# Altium schematic sheet fet_driver.SchDoc
size Tabloid
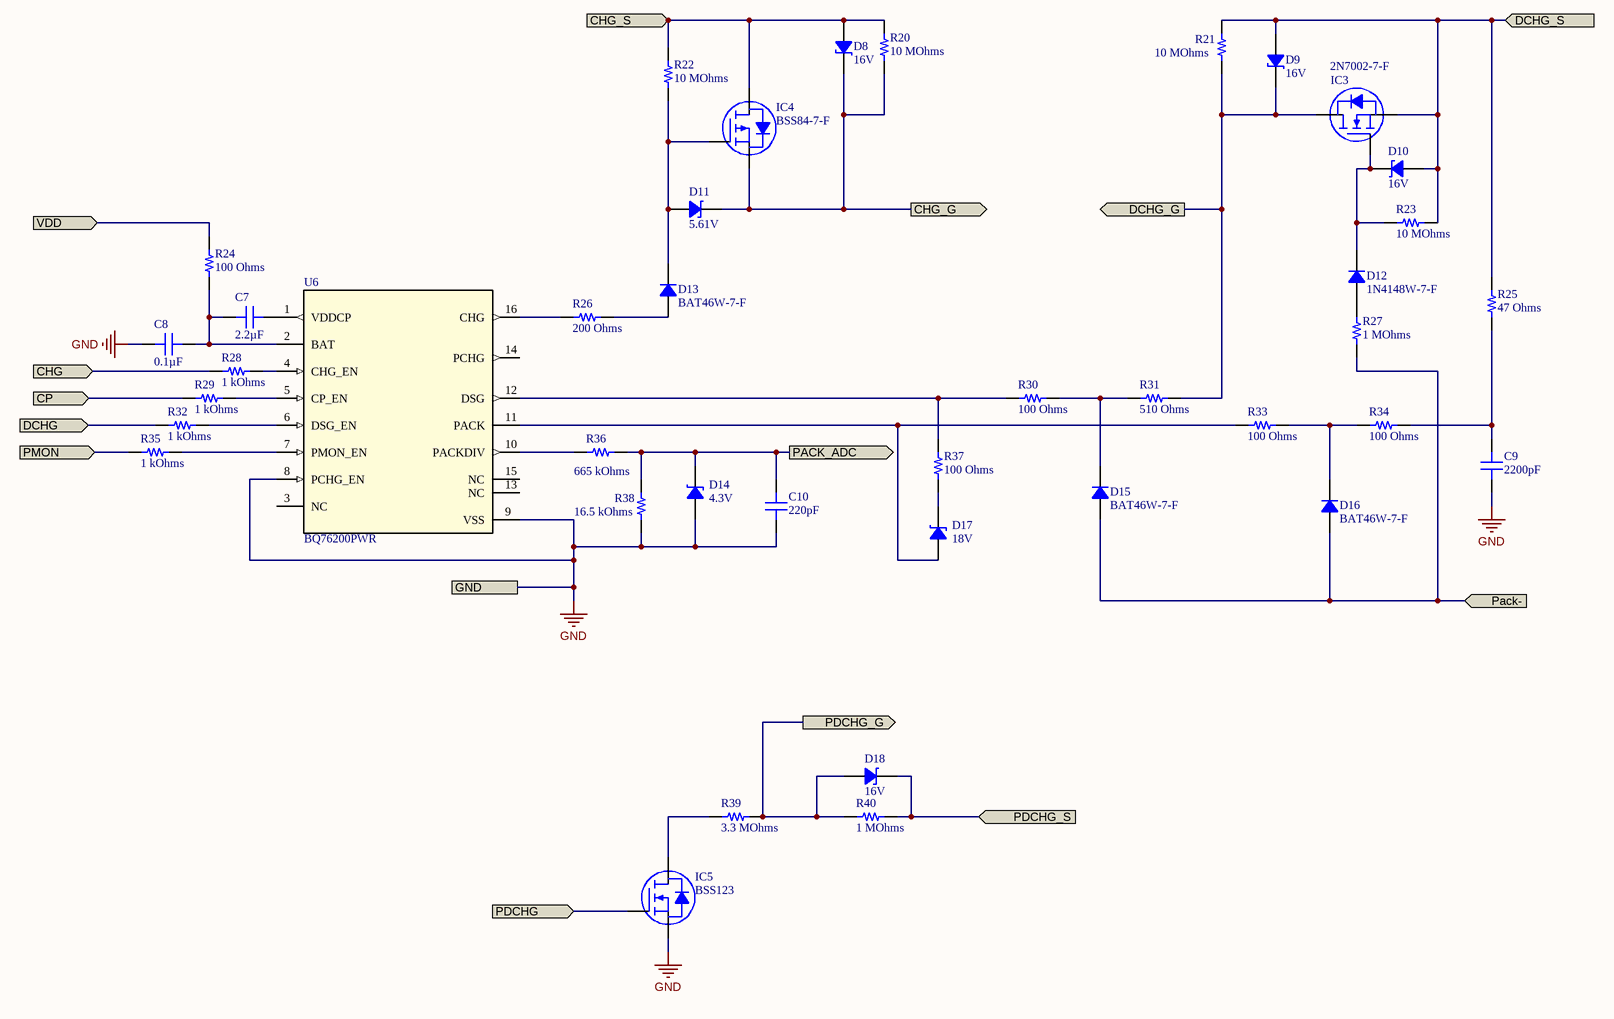
[diagram p0: fet_driver.SchDoc]

## Parts
C7  2.2µF  [CAP 1210_3225 - 2.5MM]
C8  0.1µF  [CAP 0603_1608]
C9  2200pF  [CAP 0603_1608]
C10  220pF  [CAP 0603_1608]
D8  Voltage - Zener (Nom) (Vz): 16V  [SOD-123]  (hidden comment: MMSZ5246B-7-F)
D9  Voltage - Zener (Nom) (Vz): 16V  [SOD-123]  (hidden comment: MMSZ5246B-7-F)
D10  Voltage - Zener (Nom) (Vz): 16V  [SOD-123]  (hidden comment: MMSZ5246B-7-F)
D11  Voltage - Zener (Nom) (Vz): 5.61V  [SOD523F]  (hidden comment: MM5Z5V6ST1G)
D12  1N4148W-7-F  [SOD-123]
D13  BAT46W-7-F  [SOD-123]
D14  Voltage - Zener (Nom) (Vz): 4.3V  [SOD-123]  (hidden comment: MMSZ5229BT1G)
D15  BAT46W-7-F  [SOD-123]
D16  BAT46W-7-F  [SOD-123]
D17  Voltage - Zener (Nom) (Vz): 18V  [DIODES SOT-523]  (hidden comment: MMBZ5248BT-7-F)
D18  Voltage - Zener (Nom) (Vz): 16V  [SOD-123]  (hidden comment: MMSZ5246B-7-F)
IC3  2N7002-7-F  [DIODES SOT-23-3]
IC4  BSS84-7-F  [DIODES SOT-23-3]
IC5  BSS123  [ON SEMI SOT-23-3]
R20  10 MOhms  [RES 0603_1608]
R21  10 MOhms  [RES 0603_1608]
R22  10 MOhms  [RES 0603_1608]
R23  10 MOhms  [RES 0603_1608]
R24  100 Ohms  [RES 0603_1608]
R25  47 Ohms  [RES 0603_1608]
R26  200 Ohms  [RES 0603_1608]
R27  1 MOhms  [RES 0603_1608]
R28  1 kOhms  [RES 0603_1608]
R29  1 kOhms  [RES 0603_1608]
R30  100 Ohms  [RES 0603_1608]
R31  510 Ohms  [RES 0603_1608]
R32  1 kOhms  [RES 0603_1608]
R33  100 Ohms  [RES 0603_1608]
R34  100 Ohms  [RES 0603_1608]
R35  1 kOhms  [RES 0603_1608]
R36  665 kOhms  [RES 0603_1608]
R37  100 Ohms  [RES 0603_1608]
R38  16.5 kOhms  [RES 0603_1608]
R39  3.3 MOhms  [RES 0603_1608]
R40  1 MOhms  [RES 0603_1608]
U6  BQ76200PWR  [TSSOP_16]

## Ports
CHG (in), CHG_G (out), CHG_S (in), CP (in), DCHG (in), DCHG_G (out), DCHG_S (in), GND, Pack- (in), PACK_ADC (out), PDCHG (in), PDCHG_G (out), PDCHG_S (in), PMON (in), VDD (in)

## Nets
GND: C8.1 C9.1 C10.1 D14.1 IC5.2(S) R38.1 U6.8(PCHG_EN) U6.9(VSS) ; port GND
CHG: R28.1 ; port CHG
CHG_G: D8.2 D11.2 IC4.2(S) R20.1 ; port CHG_G
CHG_S: D8.1 IC4.3(D) R20.2 R22.2 ; port CHG_S
CP: R29.1 ; port CP
DCHG: R32.1 ; port DCHG
DCHG_G: D9.2 IC3.3(D) R21.1 R31.2 ; port DCHG_G
DCHG_S: D9.1 D10.1 IC3.2(S) R21.2 R23.1 R25.2 ; port DCHG_S
Pack-: D15.1 D16.1 R27.1 ; port Pack-
PACK_ADC: C10.2 D14.2 R36.2 R38.2 ; port PACK_ADC
PDCHG: IC5.1(G) ; port PDCHG
PDCHG_G: D18.1 R39.2 R40.2 ; port PDCHG_G
PDCHG_S: D18.2 R40.1 ; port PDCHG_S
PMON: R35.1 ; port PMON
VDD: R24.2 ; port VDD
NetC7_1: C7.1 C8.2 R24.1 U6.2(BAT)
NetC7_2: C7.2 U6.1(VDDCP)
NetC9_2: C9.2 R25.1 R34.1
NetD10_2: D10.2 D12.2 IC3.1(G) R23.2
NetD11_1: D11.1 D13.2 IC4.1(G) R22.1
NetD12_1: D12.1 R27.2
NetD13_1: D13.1 R26.2
NetD15_2: D15.2 R30.1 R31.1
NetD16_2: D16.2 R33.1 R34.2
NetD17_1: D17.1 R33.2 U6.11(PACK)
NetD17_2: D17.2 R37.2
NetIC5_3: IC5.3(D) R39.1
NetR26_1: R26.1 U6.16(CHG)
NetR28_2: R28.2 U6.4(CHG_EN)
NetR29_2: R29.2 U6.5(CP_EN)
NetR30_2: R30.2 R37.1 U6.12(DSG)
NetR32_2: R32.2 U6.6(DSG_EN)
NetR35_2: R35.2 U6.7(PMON_EN)
NetR36_1: R36.1 U6.10(PACKDIV)

Not connected (* = marked no-connect by the designer): U6 3(NC) 13(NC) 14(PCHG) 15(NC)

## Library data of the parts
C7 = C3225X7R2A225K230AE: CAP CER 2.2UF 100V X7R 1210; Manufacturer: TDK Corporation; Tolerance: ±10%; Part Number: C3225X7R2A225K230AE; Value: 2.2µF; Applications: Boardflex Sensitive; Capacitance: 2.2µF; ComponentLink1Description: Datasheet; ComponentLink1URL: https://product.tdk.com/info/en/catalog/datasheets/mlcc_commercial_soft_en.pdf?ref_disty=digikey; ComponentLink2Description: DigiKey Link; ComponentLink2URL: http://digikey.com/product-detail/en/tdk-corporation/C3225X7R2A225K230AE/445-8913-1-ND/3283757; Device Package: 1210 (3225 Metric); Features: Soft Termination; LastUpdated: 9/2/2020 1:10:44 AM; Lifecycle Status: Active; Minimum Order: 1; Mounting Type: Surface Mount, MLCC; Operating Temperature: -55°C ~ 125°C; Package / Case: 1210 (3225 Metric); Packaging: TapeAndReel; PartId: 24320; Part Status: Active; Price: 0.39; Series: C; Size / Dimension: 0.126" L x 0.098" W (3.20mm x 2.50mm); Supplier 1: DigiKey; Supplier Part Number 1: 445-8913-1-ND; Temperature Coefficient: X7R; Thickness (Max): 0.098" (2.50mm); Voltage - Rated: 100V
C8 = GCJ188R72A104KA01D: CAP CER 0.1UF 100V X7R 0603; Manufacturer: Murata Electronics; Tolerance: ±10%; Part Number: GCJ188R72A104KA01D; Value: 0.1µF; Applications: Automotive, Boardflex Sensitive; Capacitance: 0.1µF; ComponentLink1Description: Datasheet; ComponentLink1URL: https://www.murata.com/~/media/webrenewal/support/library/catalog/products/capacitor/mlcc/c03e.ashx?la=en-us; ComponentLink2Description: DigiKey Link; ComponentLink2URL: http://digikey.com/product-detail/en/murata-electronics/GCJ188R72A104KA01D/490-13420-1-ND/6012292; Device Package: 0603 (1608 Metric); Features: Soft Termination; LastUpdated: 9/2/2020 1:03:01 AM; Lifecycle Status: Active; Minimum Order: 1; Mounting Type: Surface Mount, MLCC; Operating Temperature: -55°C ~ 125°C; Package / Case: 0603 (1608 Metric); Packaging: TapeAndReel; PartId: 17976; Part Status: Active; Price: 0.05; Ratings: AEC-Q200; Series: GCJ; Size / Dimension: 0.063" L x 0.031" W (1.60mm x 0.80mm); Supplier 1: DigiKey; Supplier Part Number 1: 490-13420-1-ND; Temperature Coefficient: X7R; Thickness (Max): 0.035" (0.90mm); Voltage - Rated: 100V
C9 = CGA3E2X7R2A222K080AE: CAP CER 2200PF 100V X7R 0603; Manufacturer: TDK Corporation; Tolerance: ±10%; Part Number: CGA3E2X7R2A222K080AE; Value: 2200pF; Applications: Automotive, Boardflex Sensitive; Capacitance: 2200pF; ComponentLink1Description: Datasheet; ComponentLink1URL: https://product.tdk.com/info/en/catalog/datasheets/mlcc_automotive_soft_en.pdf?ref_disty=digikey; ComponentLink2Description: DigiKey Link; ComponentLink2URL: http://digikey.com/product-detail/en/tdk-corporation/CGA3E2X7R2A222K080AE/445-173761-1-ND/5809832; Device Package: 0603 (1608 Metric); Features: Soft Termination; LastUpdated: 9/2/2020 1:03:11 AM; Lifecycle Status: Active; Minimum Order: 1; Mounting Type: Surface Mount, MLCC; Operating Temperature: -55°C ~ 125°C; Package / Case: 0603 (1608 Metric); Packaging: TapeAndReel; PartId: 14930; Part Status: Active; Price: 0.03; Ratings: AEC-Q200; Series: CGA; Size / Dimension: 0.063" L x 0.031" W (1.60mm x 0.80mm); Supplier 1: DigiKey; Supplier Part Number 1: 445-173761-1-ND; Temperature Coefficient: X7R; Thickness (Max): 0.037" (0.95mm); Voltage - Rated: 100V
C10 = CC0603KRX7R9BB221: CAP CER 220PF 50V X7R 0603; Manufacturer: Yageo; Tolerance: ±10%; Part Number: CC0603KRX7R9BB221; Value: 220pF; Applications: General Purpose; Capacitance: 220pF; ComponentLink1Description: Datasheet; ComponentLink1URL: https://www.yageo.com/upload/media/product/productsearch/datasheet/mlcc/UPY-GPHC_X7R_6.3V-to-50V_18.pdf; ComponentLink2Description: DigiKey Link; ComponentLink2URL: http://digikey.com/product-detail/en/yageo/CC0603KRX7R9BB221/311-1077-1-ND/302987; Device Package: 0603 (1608 Metric); LastUpdated: 9/2/2020 1:03:05 AM; Lifecycle Status: Active; Minimum Order: 1; Mounting Type: Surface Mount, MLCC; Operating Temperature: -55°C ~ 125°C; Package / Case: 0603 (1608 Metric); Packaging: TapeAndReel; PartId: 16734; Part Status: Active; Price: 0.01; Series: CC; Size / Dimension: 0.063" L x 0.031" W (1.60mm x 0.80mm); Supplier 1: DigiKey; Supplier Part Number 1: 311-1077-1-ND; Temperature Coefficient: X7R; Thickness (Max): 0.035" (0.90mm); Voltage - Rated: 50V
D8-D10 D18 = MMSZ5246B-7-F: DIODE ZENER 16V 500MW SOD123; Manufacturer: Diodes Incorporated; Current - Reverse Leakage @ Vr: 100nA @ 12V; Impedance (Max) (Zzt): 17 Ohms; Tolerance: ±5%; Voltage - Forward (Vf) (Max) @ If: 900mV @ 10mA; Part Number: MMSZ5246B-7-F; ComponentLink1Description: Datasheet; ComponentLink1URL: https://www.diodes.com/assets/Datasheets/ds18010.pdf; ComponentLink2Description: DigiKey Link; ComponentLink2URL: http://digikey.com/product-detail/en/diodes-incorporated/MMSZ5246B-7-F/MMSZ5246B-FDICT-ND/717912; LastUpdated: 9/2/2020 1:19:27 AM; Lifecycle Status: Active; Minimum Order: 1; Mounting Type: Surface Mount; Operating Temperature: -65°C ~ 150°C; Package / Case: SOD-123; Packaging: TapeAndReel; PartId: 1896; Part Status: Active; Power - Max: 500mW; Price: 0.04; Series: -; Supplier 1: DigiKey; Supplier Part Number 1: MMSZ5246B-FDICT-ND; Supplier Device Package: SOD-123
D11 = MM5Z5V6ST1G: DIODE ZENER 5.61V 500MW SOD523; Manufacturer: ON Semiconductor; Current - Reverse Leakage @ Vr: 1µA @ 2V; Impedance (Max) (Zzt): 40 Ohms; Tolerance: ±2%; Voltage - Forward (Vf) (Max) @ If: 900mV @ 10mA; Part Number: MM5Z5V6ST1G; ComponentLink1Description: Datasheet; ComponentLink1URL: https://www.onsemi.com/pub/Collateral/MM5Z2V4ST1-D.PDF; ComponentLink2Description: DigiKey Link; ComponentLink2URL: http://digikey.com/product-detail/en/on-semiconductor/MM5Z5V6ST1G/MM5Z5V6ST1GOSCT-ND/964551; LastUpdated: 9/2/2020 1:19:35 AM; Lifecycle Status: Active; Minimum Order: 1; Mounting Type: Surface Mount; Operating Temperature: -65°C ~ 150°C; Package / Case: SC-79, SOD-523; Packaging: TapeAndReel; PartId: 3287; Part Status: Active; Power - Max: 500mW; Price: 0.05; Series: Automotive, AEC-Q101; Supplier 1: DigiKey; Supplier Part Number 1: MM5Z5V6ST1GOSCT-ND; Supplier Device Package: SOD-523
D12 = 1N4148W-7-F: DIODE GEN PURP 100V 300MA SOD123; Manufacturer: Diodes Incorporated; Current - Average Rectified (Io): 300mA (DC); Current - Reverse Leakage @ Vr: 1µA @ 75V; Diode Type: Standard; Reverse Recovery Time (trr): 4ns; Speed: Small Signal =< 200mA (Io), Any Speed; Voltage - Forward (Vf) (Max) @ If: 1.25V @ 150mA; Part Number: 1N4148W-7-F; ComponentLink1Description: Datasheet; ComponentLink1URL: https://www.diodes.com/assets/Datasheets/ds30086.pdf; ComponentLink2Description: DigiKey Link; ComponentLink2URL: http://digikey.com/product-detail/en/diodes-incorporated/1N4148W-7-F/1N4148W-FDICT-ND/815280; LastUpdated: 9/2/2020 1:19:08 AM; Lifecycle Status: Active; Minimum Order: 1; Mounting Type: Surface Mount; Operating Temperature - Junction: -65°C ~ 150°C; Package / Case: SOD-123; Packaging: TapeAndReel; PartId: 1002; Part Status: Active; Price: 0.03; Series: -; Supplier 1: DigiKey; Supplier Part Number 1: 1N4148W-FDICT-ND; Supplier Device Package: SOD-123; Voltage - DC Reverse (Vr) (Max): 100V
D13 D15 D16 = BAT46W-7-F: DIODE SCHOTTKY 100V 150MA SOD123; Manufacturer: Diodes Incorporated; Current - Average Rectified (Io): 150mA (DC); Current - Reverse Leakage @ Vr: 2µA @ 75V; Speed: Small Signal =< 200mA (Io), Any Speed; Voltage - Forward (Vf) (Max) @ If: 450mV @ 10mA; Part Number: BAT46W-7-F; ComponentLink1Description: Datasheet; ComponentLink1URL: https://www.diodes.com/assets/Datasheets/ds30044.pdf; ComponentLink2Description: DigiKey Link; ComponentLink2URL: http://digikey.com/product-detail/en/diodes-incorporated/BAT46W-7-F/BAT46W-7FDICT-ND/2181054; Diode Type: Schottky; LastUpdated: 9/2/2020 1:19:08 AM; Lifecycle Status: Active; Minimum Order: 1; Mounting Type: Surface Mount; Operating Temperature - Junction: -55°C ~ 125°C; Package / Case: SOD-123; Packaging: TapeAndReel; PartId: 2210; Part Status: Active; Price: 0.07; Series: Automotive, AEC-Q101; Supplier 1: DigiKey; Supplier Part Number 1: BAT46W-7FDICT-ND; Supplier Device Package: SOD-123; Voltage - DC Reverse (Vr) (Max): 100V
D14 = MMSZ5229BT1G: DIODE ZENER 4.3V 500MW SOD123; Manufacturer: ON Semiconductor; Current - Reverse Leakage @ Vr: 5µA @ 1V; Impedance (Max) (Zzt): 22 Ohms; Tolerance: ±5%; Voltage - Forward (Vf) (Max) @ If: 900mV @ 10mA; Part Number: MMSZ5229BT1G; ComponentLink1Description: Datasheet; ComponentLink1URL: http://www.onsemi.com/pub/Collateral/MMSZ5221BT1-D.PDF; ComponentLink2Description: DigiKey Link; ComponentLink2URL: http://digikey.com/product-detail/en/on-semiconductor/MMSZ5229BT1G/MMSZ5229BT1GOSCT-ND/1139889; LastUpdated: 9/2/2020 1:19:25 AM; Lifecycle Status: Active; Minimum Order: 1; Mounting Type: Surface Mount; Operating Temperature: -55°C ~ 150°C; Package / Case: SOD-123; Packaging: TapeAndReel; PartId: 2271; Part Status: Active; Power - Max: 500mW; Price: 0.04; Series: -; Supplier 1: DigiKey; Supplier Part Number 1: MMSZ5229BT1GOSCT-ND; Supplier Device Package: SOD-123
D17 = MMBZ5248BT-7-F: DIODE ZENER 18V 150MW SOT523; Manufacturer: Diodes Incorporated; Current - Reverse Leakage @ Vr: 100nA @ 14V; Impedance (Max) (Zzt): 21 Ohms; Tolerance: ±5%; Voltage - Forward (Vf) (Max) @ If: 900mV @ 10mA; Part Number: MMBZ5248BT-7-F; ComponentLink1Description: Datasheet; ComponentLink1URL: https://www.diodes.com/assets/Datasheets/ds30267.pdf; ComponentLink2Description: DigiKey Link; ComponentLink2URL: http://digikey.com/product-detail/en/diodes-incorporated/MMBZ5248BT-7-F/MMBZ5248BT-7-FDICT-ND/5218419; LastUpdated: 9/2/2020 1:21:31 AM; Lifecycle Status: Active; Minimum Order: 1; Mounting Type: Surface Mount; Operating Temperature: -65°C ~ 150°C; Package / Case: SOT-523; Packaging: CutTape; PartId: 789; Part Status: Active; Power - Max: 150mW; Price: 0.39; Series: -; Supplier 1: DigiKey; Supplier Part Number 1: MMBZ5248BT-7-FDICT-ND; Supplier Device Package: SOT-523
IC3 = 2N7002-7-F: MOSFET N-CH 60V 115MA SOT23-3; Manufacturer: Diodes Incorporated; Current - Continuous Drain (Id) @ 25°C: 115mA (Ta); Drive Voltage (Max Rds On,  Min Rds On): 5V, 10V; FET Type: N-Channel; Input Capacitance (Ciss) (Max) @ Vds: 50pF @ 25V; Power Dissipation (Max): 370mW (Ta); Rds On (Max) @ Id, Vgs: 7.5Ohm @ 50mA, 5V; Vgs (Max): ±20V; Vgs(th) (Max) @ Id: 2.5V @ 250µA; Part Number: 2N7002-7-F; ComponentLink1Description: Datasheet; ComponentLink1URL: https://www.diodes.com/assets/Datasheets/ds11303.pdf; ComponentLink2Description: DigiKey Link; ComponentLink2URL: http://digikey.com/product-detail/en/diodes-incorporated/2N7002-7-F/2N7002-FDICT-ND/717800; Drain to Source Voltage (Vdss): 60V; LastUpdated: 9/2/2020 1:25:03 AM; Lifecycle Status: Active; Minimum Order: 1; Mounting Type: Surface Mount; Operating Temperature: -55°C ~ 150°C (TJ); Package / Case: TO-236-3, SC-59, SOT-23-3; Packaging: TapeAndReel; Part Status: Active; Price: 0.03; Series: -; Supplier 1: DigiKey; Supplier Part Number 1: 2N7002-FDICT-ND; Supplier Device Package: SOT-23-3; Technology: MOSFET (Metal Oxide)
IC4 = BSS84-7-F: MOSFET P-CH 50V 130MA SOT23-3; Manufacturer: Diodes Incorporated; Current - Continuous Drain (Id) @ 25°C: 130mA (Ta); Drive Voltage (Max Rds On,  Min Rds On): 5V; FET Type: P-Channel; Input Capacitance (Ciss) (Max) @ Vds: 45pF @ 25V; Power Dissipation (Max): 300mW (Ta); Rds On (Max) @ Id, Vgs: 10Ohm @ 100mA, 5V; Vgs (Max): ±20V; Vgs(th) (Max) @ Id: 2V @ 1mA; Part Number: BSS84-7-F; ComponentLink1Description: Datasheet; ComponentLink1URL: https://www.diodes.com/assets/Datasheets/ds30149.pdf; ComponentLink2Description: DigiKey Link; ComponentLink2URL: http://digikey.com/product-detail/en/diodes-incorporated/BSS84-7-F/BSS84-FDICT-ND/717844; Drain to Source Voltage (Vdss): 50V; LastUpdated: 9/2/2020 1:25:04 AM; Lifecycle Status: Active; Minimum Order: 1; Mounting Type: Surface Mount; Operating Temperature: -55°C ~ 150°C (TJ); Package / Case: TO-236-3, SC-59, SOT-23-3; Packaging: TapeAndReel; Part Status: Active; Price: 0.03; Series: -; Supplier 1: DigiKey; Supplier Part Number 1: BSS84-FDICT-ND; Supplier Device Package: SOT-23-3; Technology: MOSFET (Metal Oxide)
IC5 = BSS123: MOSFET N-CH 100V 170MA SOT-23; Manufacturer: ON Semiconductor; Current - Continuous Drain (Id) @ 25°C: 170mA (Ta); Drive Voltage (Max Rds On,  Min Rds On): 4.5V, 10V; FET Type: N-Channel; Gate Charge (Qg) (Max) @ Vgs: 2.5nC @ 10V; Input Capacitance (Ciss) (Max) @ Vds: 73pF @ 25V; Power Dissipation (Max): 360mW (Ta); Rds On (Max) @ Id, Vgs: 6Ohm @ 170mA, 10V; Vgs (Max): ±20V; Vgs(th) (Max) @ Id: 2V @ 1mA; Part Number: BSS123; ComponentLink1Description: Datasheet; ComponentLink1URL: https://www.onsemi.com/pub/Collateral/BSS123-D.PDF; ComponentLink2Description: DigiKey Link; ComponentLink2URL: http://digikey.com/product-detail/en/on-semiconductor/BSS123/BSS123NCT-ND/244665; Drain to Source Voltage (Vdss): 100V; LastUpdated: 9/2/2020 1:25:08 AM; Lifecycle Status: Active; Minimum Order: 1; Mounting Type: Surface Mount; Operating Temperature: -55°C ~ 150°C (TJ); Package / Case: TO-236-3, SC-59, SOT-23-3; Packaging: TapeAndReel; Part Status: Active; Price: 0.06; Series: -; Supplier 1: DigiKey; Supplier Part Number 1: BSS123NCT-ND; Supplier Device Package: SOT-23-3; Technology: MOSFET (Metal Oxide)
R20-R23 = CRCW060310M0FKEA: RES SMD 10M OHM 1% 1/10W 0603; Manufacturer: Vishay Dale; Power (Watts): 0.1W, 1/10W; Temperature Coefficient: ±100ppm/°C; Part Number: CRCW060310M0FKEA; Value: 10 MOhms; ComponentLink1Description: Datasheet; ComponentLink1URL: http://www.vishay.com/docs/20035/dcrcwe3.pdf; ComponentLink2Description: DigiKey Link; ComponentLink2URL: http://digikey.com/product-detail/en/vishay-dale/CRCW060310M0FKEA/541-10.0MHCT-ND/1180266; Composition: Thick Film; Device Package: 0603 (1608 Metric); Features: Automotive AEC-Q200; Height - Seated (Max): 0.020" (0.50mm); LastUpdated: 9/2/2020 1:10:08 AM; Lifecycle Status: Active; Minimum Order: 1; Number of Terminations: 2; Operating Temperature: -55°C ~ 155°C; Package / Case: 0603 (1608 Metric); Packaging: CutTape; PartId: 12816; Part Status: Active; Price: 0.10; Ratings: AEC-Q200; Resistance: 10 MOhms; Series: CRCW; Size / Dimension: 0.061" L x 0.033" W (1.55mm x 0.85mm); Supplier 1: DigiKey; Supplier Part Number 1: 541-10.0MHCT-ND; Supplier Device Package: 0603; Tolerance: ±1%
R24 R30 R33 R34 R37 = CRCW0603100RFKTA: RES SMD 100 OHM 1% 1/10W 0603; Manufacturer: Vishay Dale; Power (Watts): 0.1W, 1/10W; Temperature Coefficient: ±100ppm/°C; Part Number: CRCW0603100RFKTA; Value: 100 Ohms; ComponentLink1Description: Datasheet; ComponentLink1URL: http://www.vishay.com/docs/20008/dcrcw.pdf; ComponentLink2Description: DigiKey Link; ComponentLink2URL: http://digikey.com/product-detail/en/vishay-dale/CRCW0603100RFKTA/541-2976-1-ND/6073619; Composition: Thick Film; Device Package: 0603 (1608 Metric); Features: Automotive AEC-Q200; Height - Seated (Max): 0.020" (0.50mm); LastUpdated: 9/2/2020 1:09:58 AM; Lifecycle Status: Active; Minimum Order: 1; Number of Terminations: 2; Operating Temperature: -55°C ~ 155°C; Package / Case: 0603 (1608 Metric); Packaging: TapeAndReel; PartId: 17521; Part Status: Active; Price: 0.01; Ratings: AEC-Q200; Resistance: 100 Ohms; Series: CRCW; Size / Dimension: 0.063" L x 0.033" W (1.60mm x 0.85mm); Supplier 1: DigiKey; Supplier Part Number 1: 541-2976-1-ND; Supplier Device Package: 0603; Tolerance: ±1%
R25 = CRCW060347R0FKEA: RES SMD 47 OHM 1% 1/10W 0603; Manufacturer: Vishay Dale; Power (Watts): 0.1W, 1/10W; Temperature Coefficient: ±100ppm/°C; Part Number: CRCW060347R0FKEA; Value: 47 Ohms; ComponentLink1Description: Datasheet; ComponentLink1URL: http://www.vishay.com/docs/20035/dcrcwe3.pdf; ComponentLink2Description: DigiKey Link; ComponentLink2URL: http://digikey.com/product-detail/en/vishay-dale/CRCW060347R0FKEA/541-47.0HCT-ND/1179657; Composition: Thick Film; Device Package: 0603 (1608 Metric); Features: Automotive AEC-Q200; Height - Seated (Max): 0.020" (0.50mm); LastUpdated: 9/2/2020 1:10:02 AM; Lifecycle Status: Active; Minimum Order: 1; Number of Terminations: 2; Operating Temperature: -55°C ~ 155°C; Package / Case: 0603 (1608 Metric); Packaging: CutTape; PartId: 15336; Part Status: Active; Price: 0.10; Ratings: AEC-Q200; Resistance: 47 Ohms; Series: CRCW; Size / Dimension: 0.061" L x 0.033" W (1.55mm x 0.85mm); Supplier 1: DigiKey; Supplier Part Number 1: 541-47.0HCT-ND; Supplier Device Package: 0603; Tolerance: ±1%
R26 = CRCW0603200RFKEA: RES SMD 200 OHM 1% 1/10W 0603; Manufacturer: Vishay Dale; Power (Watts): 0.1W, 1/10W; Temperature Coefficient: ±100ppm/°C; Part Number: CRCW0603200RFKEA; Value: 200 Ohms; ComponentLink1Description: Datasheet; ComponentLink1URL: http://www.vishay.com/docs/20035/dcrcwe3.pdf; ComponentLink2Description: DigiKey Link; ComponentLink2URL: http://digikey.com/product-detail/en/vishay-dale/CRCW0603200RFKEA/541-200HCT-ND/1179727; Composition: Thick Film; Device Package: 0603 (1608 Metric); Features: Automotive AEC-Q200; Height - Seated (Max): 0.020" (0.50mm); LastUpdated: 9/2/2020 1:10:09 AM; Lifecycle Status: Active; Minimum Order: 1; Number of Terminations: 2; Operating Temperature: -55°C ~ 155°C; Package / Case: 0603 (1608 Metric); Packaging: CutTape; PartId: 12561; Part Status: Active; Price: 0.10; Ratings: AEC-Q200; Resistance: 200 Ohms; Series: CRCW; Size / Dimension: 0.061" L x 0.033" W (1.55mm x 0.85mm); Supplier 1: DigiKey; Supplier Part Number 1: 541-200HCT-ND; Supplier Device Package: 0603; Tolerance: ±1%
R27 R40 = CRCW06031M00FKEA: RES SMD 1M OHM 1% 1/10W 0603; Manufacturer: Vishay Dale; Power (Watts): 0.1W, 1/10W; Temperature Coefficient: ±100ppm/°C; Part Number: CRCW06031M00FKEA; Value: 1 MOhms; ComponentLink1Description: Datasheet; ComponentLink1URL: http://www.vishay.com/docs/20035/dcrcwe3.pdf; ComponentLink2Description: DigiKey Link; ComponentLink2URL: http://digikey.com/product-detail/en/vishay-dale/CRCW06031M00FKEA/541-1.00MHCT-ND/1180152; Composition: Thick Film; Device Package: 0603 (1608 Metric); Features: Automotive AEC-Q200; Height - Seated (Max): 0.020" (0.50mm); LastUpdated: 9/2/2020 1:10:09 AM; Lifecycle Status: Active; Minimum Order: 1; Number of Terminations: 2; Operating Temperature: -55°C ~ 155°C; Package / Case: 0603 (1608 Metric); Packaging: CutTape; PartId: 12567; Part Status: Active; Price: 0.10; Ratings: AEC-Q200; Resistance: 1 MOhms; Series: CRCW; Size / Dimension: 0.061" L x 0.033" W (1.55mm x 0.85mm); Supplier 1: DigiKey; Supplier Part Number 1: 541-1.00MHCT-ND; Supplier Device Package: 0603; Tolerance: ±1%
R28 R29 R32 R35 = CRCW06031K00FKEA: RES SMD 1K OHM 1% 1/10W 0603; Manufacturer: Vishay Dale; Power (Watts): 0.1W, 1/10W; Temperature Coefficient: ±100ppm/°C; Part Number: CRCW06031K00FKEA; Value: 1 kOhms; ComponentLink1Description: Datasheet; ComponentLink1URL: http://www.vishay.com/docs/20035/dcrcwe3.pdf; ComponentLink2Description: DigiKey Link; ComponentLink2URL: http://digikey.com/product-detail/en/vishay-dale/CRCW06031K00FKEA/541-1.00KHCT-ND/1179809; Composition: Thick Film; Device Package: 0603 (1608 Metric); Features: Automotive AEC-Q200; Height - Seated (Max): 0.020" (0.50mm); LastUpdated: 9/2/2020 1:09:36 AM; Lifecycle Status: Active; Minimum Order: 1; Number of Terminations: 2; Operating Temperature: -55°C ~ 155°C; Package / Case: 0603 (1608 Metric); Packaging: CutTape; PartId: 24637; Part Status: Active; Price: 0.10; Ratings: AEC-Q200; Resistance: 1 kOhms; Series: CRCW; Size / Dimension: 0.061" L x 0.033" W (1.55mm x 0.85mm); Supplier 1: DigiKey; Supplier Part Number 1: 541-1.00KHCT-ND; Supplier Device Package: 0603; Tolerance: ±1%
R31 = CRCW0603510RFKEA: RES SMD 510 OHM 1% 1/10W 0603; Manufacturer: Vishay Dale; Power (Watts): 0.1W, 1/10W; Temperature Coefficient: ±100ppm/°C; Part Number: CRCW0603510RFKEA; Value: 510 Ohms; ComponentLink1Description: Datasheet; ComponentLink1URL: http://www.vishay.com/docs/20035/dcrcwe3.pdf; ComponentLink2Description: DigiKey Link; ComponentLink2URL: http://digikey.com/product-detail/en/vishay-dale/CRCW0603510RFKEA/541-510HCT-ND/1179775; Composition: Thick Film; Device Package: 0603 (1608 Metric); Features: Automotive AEC-Q200; Height - Seated (Max): 0.020" (0.50mm); LastUpdated: 9/2/2020 1:10:08 AM; Lifecycle Status: Active; Minimum Order: 1; Number of Terminations: 2; Operating Temperature: -55°C ~ 155°C; Package / Case: 0603 (1608 Metric); Packaging: CutTape; PartId: 12640; Part Status: Active; Price: 0.10; Ratings: AEC-Q200; Resistance: 510 Ohms; Series: CRCW; Size / Dimension: 0.061" L x 0.033" W (1.55mm x 0.85mm); Supplier 1: DigiKey; Supplier Part Number 1: 541-510HCT-ND; Supplier Device Package: 0603; Tolerance: ±1%
R36 = RC0603FR-07665KL: RES SMD 665K OHM 1% 1/10W 0603; Manufacturer: Yageo; Power (Watts): 0.1W, 1/10W; Temperature Coefficient: ±100ppm/°C; Part Number: RC0603FR-07665KL; Value: 665 kOhms; ComponentLink1Description: Datasheet; ComponentLink1URL: https://www.yageo.com/upload/media/product/productsearch/datasheet/rchip/PYu-RC_Group_51_RoHS_L_10.pdf; ComponentLink2Description: DigiKey Link; ComponentLink2URL: http://digikey.com/product-detail/en/yageo/RC0603FR-07665KL/311-665KHRCT-ND/730297; Composition: Thick Film; Device Package: 0603 (1608 Metric); Features: Moisture Resistant; Height - Seated (Max): 0.022" (0.55mm); LastUpdated: 9/2/2020 1:09:44 AM; Lifecycle Status: Active; Minimum Order: 1; Number of Terminations: 2; Operating Temperature: -55°C ~ 155°C; Package / Case: 0603 (1608 Metric); Packaging: CutTape; PartId: 22846; Part Status: Active; Price: 0.10; Resistance: 665 kOhms; Series: RC; Size / Dimension: 0.063" L x 0.031" W (1.60mm x 0.80mm); Supplier 1: DigiKey; Supplier Part Number 1: 311-665KHRCT-ND; Supplier Device Package: 0603; Tolerance: ±1%
R38 = CRCW060316K5FKEA: RES SMD 16.5K OHM 1% 1/10W 0603; Manufacturer: Vishay Dale; Power (Watts): 0.1W, 1/10W; Temperature Coefficient: ±100ppm/°C; Part Number: CRCW060316K5FKEA; Value: 16.5 kOhms; ComponentLink1Description: Datasheet; ComponentLink1URL: http://www.vishay.com/docs/20035/dcrcwe3.pdf; ComponentLink2Description: DigiKey Link; ComponentLink2URL: http://digikey.com/product-detail/en/vishay-dale/CRCW060316K5FKEA/541-16.5KHCT-ND/1179947; Composition: Thick Film; Device Package: 0603 (1608 Metric); Features: Automotive AEC-Q200; Height - Seated (Max): 0.020" (0.50mm); LastUpdated: 9/2/2020 1:09:44 AM; Lifecycle Status: Active; Minimum Order: 1; Number of Terminations: 2; Operating Temperature: -55°C ~ 155°C; Package / Case: 0603 (1608 Metric); Packaging: CutTape; PartId: 22960; Part Status: Active; Price: 0.10; Ratings: AEC-Q200; Resistance: 16.5 kOhms; Series: CRCW; Size / Dimension: 0.061" L x 0.033" W (1.55mm x 0.85mm); Supplier 1: DigiKey; Supplier Part Number 1: 541-16.5KHCT-ND; Supplier Device Package: 0603; Tolerance: ±1%
R39 = CRCW06033M30FKEA: RES SMD 3.3M OHM 1% 1/10W 0603; Manufacturer: Vishay Dale; Power (Watts): 0.1W, 1/10W; Temperature Coefficient: ±100ppm/°C; Part Number: CRCW06033M30FKEA; Value: 3.3 MOhms; ComponentLink1Description: Datasheet; ComponentLink1URL: http://www.vishay.com/docs/20035/dcrcwe3.pdf; ComponentLink2Description: DigiKey Link; ComponentLink2URL: http://digikey.com/product-detail/en/vishay-dale/CRCW06033M30FKEA/541-3.30MHCT-ND/1180209; Composition: Thick Film; Device Package: 0603 (1608 Metric); Features: Automotive AEC-Q200; Height - Seated (Max): 0.020" (0.50mm); LastUpdated: 9/2/2020 1:09:32 AM; Lifecycle Status: Active; Minimum Order: 1; Number of Terminations: 2; Operating Temperature: -55°C ~ 155°C; Package / Case: 0603 (1608 Metric); Packaging: CutTape; PartId: 25411; Part Status: Active; Price: 0.10; Ratings: AEC-Q200; Resistance: 3.3 MOhms; Series: CRCW; Size / Dimension: 0.061" L x 0.033" W (1.55mm x 0.85mm); Supplier 1: DigiKey; Supplier Part Number 1: 541-3.30MHCT-ND; Supplier Device Package: 0603; Tolerance: ±1%
U6 = BQ76200PWR: Battery Battery Protection IC Multi-Chemistry 16-TSSOP; Manufacturer: Texas Instruments; PIN_COUNT: 16; Output Voltage: 14V; Operating Supply Voltage: 75V; Application_BuildNumber: *; PartNumber: BQ76200PWR; Alternate_PartNumber: BQ76200PW; PackageReference: PW0016A; MountType: SMT; CompType: IC; RoHS: Y; RefDes: RefDes; Type: DEV; Value: Value; Copyright: Copyright (C) 2018 Accelerated Designs. All rights reserved; Supplier 1: Digi-Key; Manufacturer Part Number: BQ76200PWR; Stock 1: 7339; Pricing 1: 1=2.34, 10=2.099, 25=1.98, 100=1.584, 250=1.386, 500=1.3464, 1000=1.0692 (USD); Mount: Surface Mount; Case/Package: TSSOP; Number of Pins: 16; Contact Plating: Gold; Min Operating Temperature: -40°C; Max Operating Temperature: 85°C; Packaging: Tape and Reel; Lead Free: Lead Free; ComponentLink1URL: http://www.ti.com/lit/ds/symlink/bq76200.pdf?src-supplier=Digi-Key; ComponentLink1Description: http://www.ti.com/lit/ds/symlink/bq76200.pdf?src-supplier=Digi-Key; ComponentLink2URL: http://www.ti.com/lit/gpn/bq76200?src-supplier=Mouser; ComponentLink2Description: http://www.ti.com/lit/gpn/bq76200?src-supplier=Mouser; Supplier Part Number 1: 296-43273-6-ND